# Altium project Front.PrjPcb
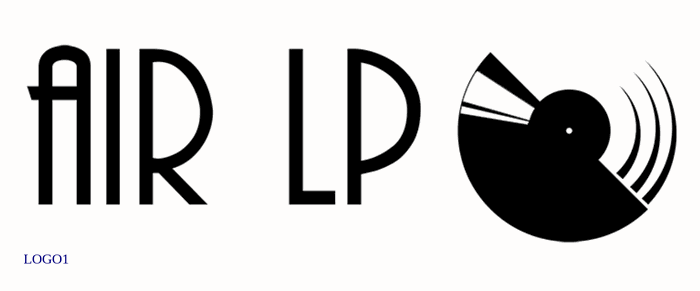
[diagram p0: Front.SchDoc]
1 sheet, 1 parts. Net scope: global (net labels, ports and power ports of the same name join across sheets).
Board file: Front.PcbDoc

## Sheet Front.SchDoc
size A3

### Parts
LOGO1  LOGO-AIRLP  [LOGO-AIR-LP]  (value not drawn)

### Library data of the parts
LOGO1 = LOGO-AIRLP: LOGO AIR LP